# EAGLE schematic SmartSensorWifi (EAGLE 6.5.0)
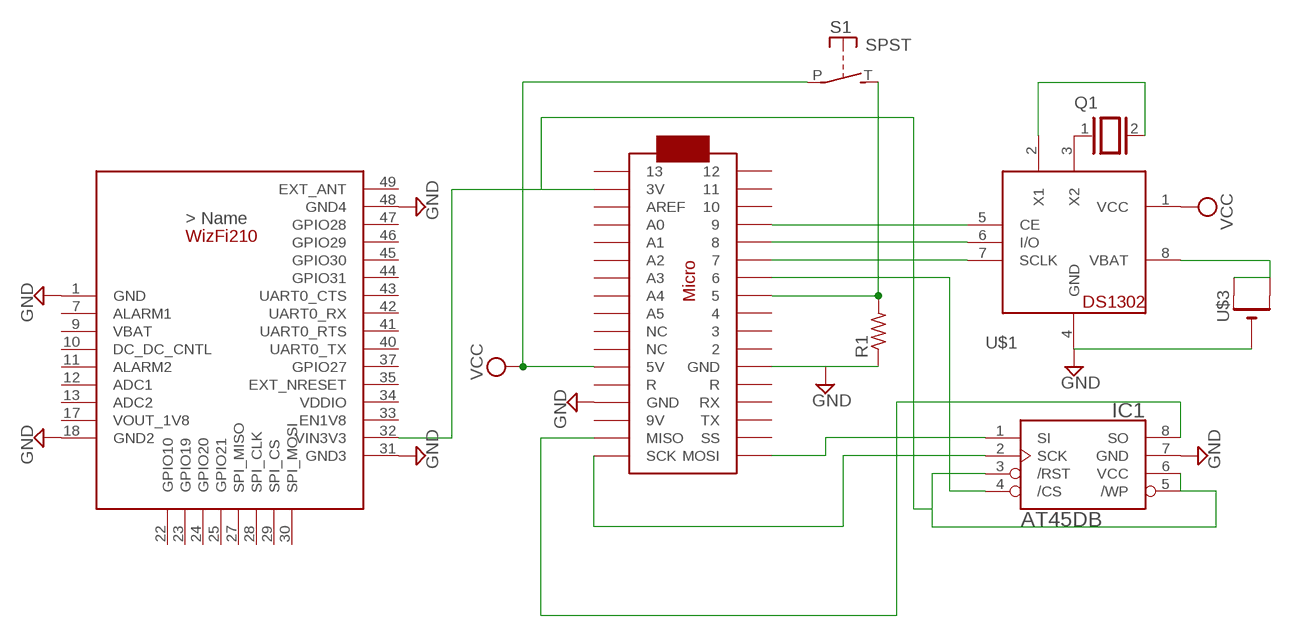
[diagram p0: schematic, sheet 1]

## Parts
IC1  AT45DB-S  [SOIC8_208MIL]
Q1  XTAL  [Q]
R1  FLIPFLOP-RES  [0805-THM]
S1  SPST  [JUDCOSPST]
U$1  DS1302  [DIL08-ROUND]
U$2  ARDUINOMICRO  [ARDUINOMICRO]
U$3  CR2032THM  [CR2032-THRU]
WIFI1  WIZFI210  [WIZFI210]

## Nets
GND: IC1.7(GND) R1.1 U$1.4(GND) U$2.P$12(GND) U$2.P$21(GND) U$3.- WIFI1.1(GND) WIFI1.18(GND2) WIFI1.31(GND3) WIFI1.48(GND4)
N$1: U$1.5(CE) U$2.P$4
N$2: Q1.1 U$1.3(X2)
N$3: Q1.2 U$1.2(X1)
N$4: U$1.7(SCLK) U$2.P$6
N$5: U$1.6(I/O) U$2.P$5
N$6: IC1.8(SO) U$2.P$19(MISO)
N$7: IC1.2(SCK) U$2.P$18(SCK)
N$8: IC1.1(SI) U$2.P$17(MOSI)
N$9: IC1.3(/RST) IC1.5(/WP) IC1.6(VCC) U$2.P$33(3V) WIFI1.32(VIN3V3)
N$10: U$1.8(VBAT) U$3.+1(+) U$3.+2(+1)
N$11: IC1.4(/CS) U$2.P$7
N$12: R1.2 S1.T(S) U$2.P$8
VCC: S1.P U$1.1(VCC) U$2.P$23(5V)
Unconnected: U$2.P$1 U$2.P$2 U$2.P$3 U$2.P$9 U$2.P$10 U$2.P$11 U$2.P$13(R) U$2.P$14(RX) U$2.P$15(TX) U$2.P$16(SS) U$2.P$20(9V) U$2.P$22(R) U$2.P$24(NC) U$2.P$25(NC) U$2.P$26(A5) U$2.P$27(A4) U$2.P$28(A3) U$2.P$29(A2) U$2.P$30(A1) U$2.P$31(A0) U$2.P$32(AREF) U$2.P$34 WIFI1.7(ALARM1) WIFI1.10(DC_DC_CNTL) WIFI1.11(ALARM2) WIFI1.12(ADC1) WIFI1.13(ADC2) WIFI1.22(GPIO10) WIFI1.23(GPIO19) WIFI1.24(GPIO20) WIFI1.25(GPIO21) WIFI1.27(SPI_MISO) WIFI1.28(SPI_CLK) WIFI1.29(SPI_CS) WIFI1.30(SPI_MOSI) WIFI1.33(EN1V8) WIFI1.34(VDDIO) WIFI1.35(EXT_NRESET) WIFI1.37(GPIO27) WIFI1.40(UART0_TX) WIFI1.41(UART0_RTS) WIFI1.42(UART0_RX) WIFI1.43(UART0_CTS) WIFI1.44(GPIO31) WIFI1.45(GPIO30) WIFI1.46(GPIO29) WIFI1.47(GPIO28) WIFI1.49(EXT_ANT)

## Power pins joined to a net without a drawn wire
VBAT: WIFI1.9(VBAT)
VOUT_1V8: WIFI1.17(VOUT_1V8)

## Library data of the parts
IC1 = adafruit:AT45DB
Q1 = special:XTAL: CRYSTAL
R1 = adafruit:FLIPFLOP-RES: Flip Flop resistor An 0805 resistor inside a standard 1/4W 5% resistor. Makes for easy mods
S1 = adafruit:SPST: Judco 50-0015-00
U$1 = adafruit:DS1302: DS1302 - Real time clock with supercap trickle charger
U$2 = adafruit:ARDUINOMICRO
U$3 = adafruit:CR2032
WIFI1 = SmartSensorWifi:WIZFI210